# Altium schematic sheet LoRaGW_MiniPCIe.SchDoc
size A4; Organization: Altium Limited; Address1: L3, 12a Rodborough Rd; Address2: Frenchs Forest; Address3: NSW; Address4: Australia 2086
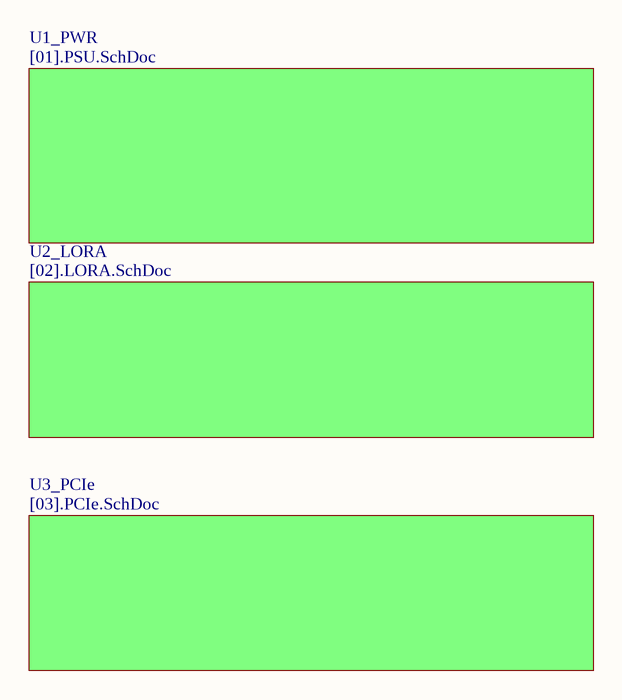
[diagram p0: LoRaGW_MiniPCIe.SchDoc]

## Sub-sheets
U1_PWR = [01].PSU.SchDoc: no entries
U2_LORA = [02].LORA.SchDoc: no entries
U3_PCIe = [03].PCIe.SchDoc: no entries

## Notes on the sheet
- Title
- Size:
- Date:
- A4
- Number:
- Time:
- Revision:
- Sheet
- of
- File: